# Altium schematic sheet JTAG_MCU.SchDoc
size A3
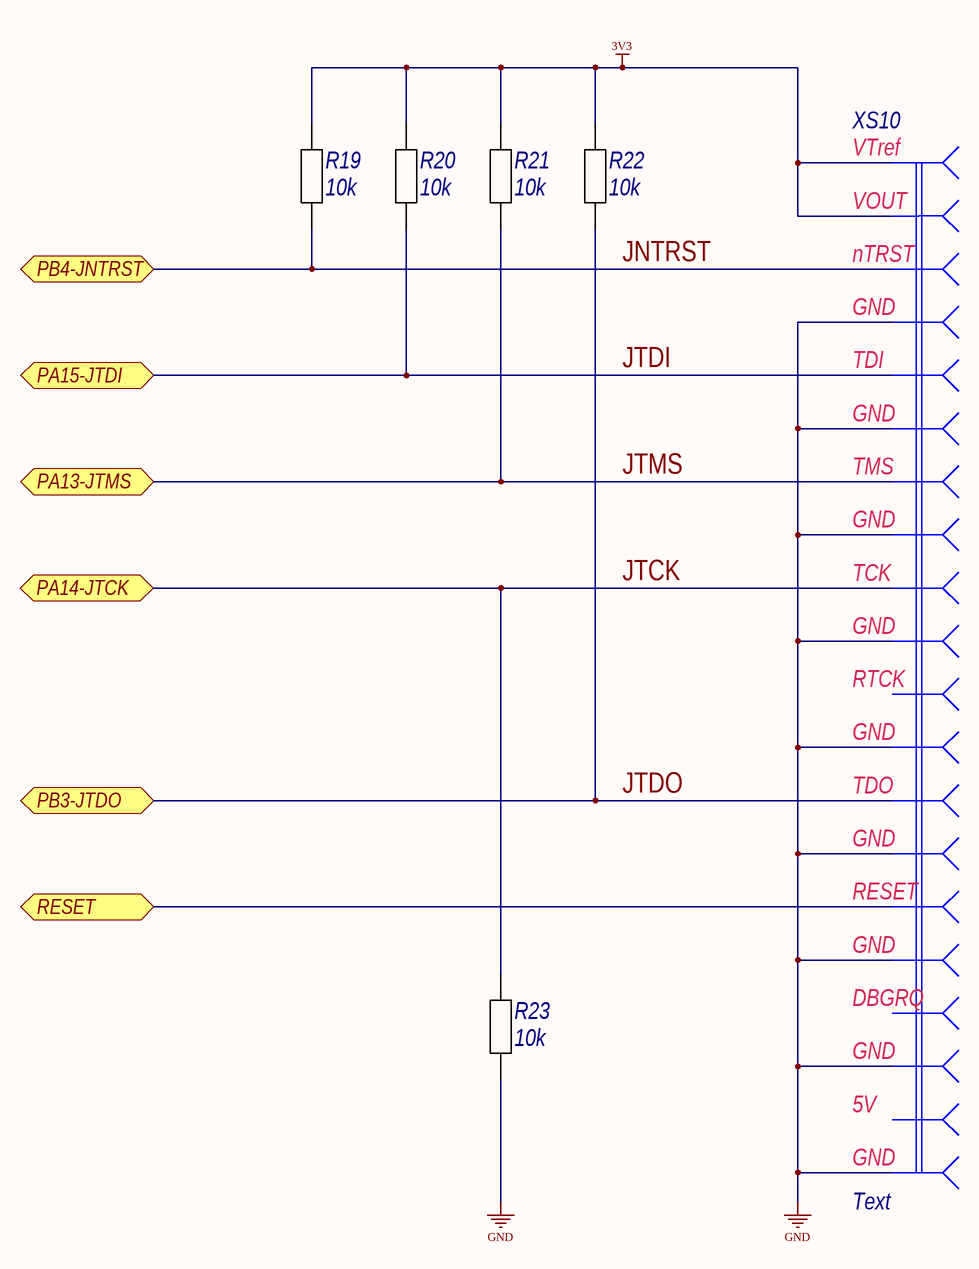
[diagram p0: JTAG_MCU.SchDoc]

## Parts
R19  10k  [C0805R]
R20  10k  [C0805R]
R21  10k  [C0805R]
R22  10k  [C0805R]
R23  10k  [C0805R]
XS10  Text  [IDC-20]

## Ports
PA13-JTMS (bidir), PA14-JTCK (bidir), PA15-JTDI (bidir), PB3-JTDO (bidir), PB4-JNTRST (bidir), RESET (bidir)

## Nets
3V3: R19.2 R20.2 R21.2 R22.2 XS10.1 XS10.2
GND: R23.1 XS10.4 XS10.6 XS10.8 XS10.10 XS10.12 XS10.14 XS10.16 XS10.18 XS10.20
JNTRST: R19.1 XS10.3 ; port PB4-JNTRST
JTCK: R23.2 XS10.9 ; port PA14-JTCK
JTDI: R20.1 XS10.5 ; port PA15-JTDI
JTDO: R22.1 XS10.13 ; port PB3-JTDO
JTMS: R21.1 XS10.7 ; port PA13-JTMS
RESET: XS10.15 ; port RESET

Not connected (* = marked no-connect by the designer): XS10 11 17 19

## Notes on the sheet
- (in symbol JTAG) VTref; VOUT; nTRST; GND; TDI; TMS; TCK; RTCK; TDO; RESET; DBGRQ; 5V

## Library data of the parts
R19-R23 = R0805: Published: 24.03.2010; Publisher: Andrew Danich; Type: Резистор
XS10 = JTAG: Value: Connector; Published: 07.03.2013; Publisher: Andrew Danich; Type: Розетка